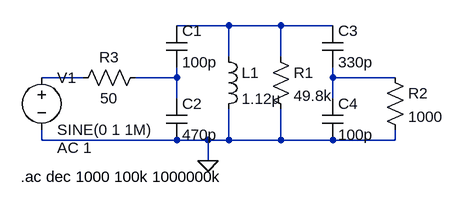
[diagram p0: schematic Circuito_Sintonizante.asc]
Circuito_Sintonizante.asc, the LTspice schematic file:
Version 4
SHEET 1 880 680
WIRE 112 112 32 112
WIRE 192 112 112 112
WIRE 272 112 192 112
WIRE 112 160 112 112
WIRE 192 160 192 112
WIRE -112 192 -176 192
WIRE 32 192 32 176
WIRE 32 192 -32 192
WIRE 272 192 272 176
WIRE 368 192 272 192
WIRE 32 224 32 192
WIRE 272 224 272 192
WIRE -176 288 -176 272
WIRE 32 288 -176 288
WIRE 80 288 32 288
WIRE 112 288 112 240
WIRE 112 288 80 288
WIRE 192 288 192 240
WIRE 192 288 112 288
WIRE 272 288 192 288
WIRE 368 288 368 272
WIRE 368 288 272 288
WIRE 80 320 80 288
FLAG 80 320 0
SYMBOL cap 16 112 R0
SYMATTR InstName C1
SYMATTR Value 100p
SYMBOL cap 16 224 R0
SYMATTR InstName C2
SYMATTR Value 470p
SYMBOL res 176 144 R0
SYMATTR InstName R1
SYMATTR Value 49.8k
SYMBOL ind 96 144 R0
SYMATTR InstName L1
SYMATTR Value 1.12µ
SYMBOL cap 256 112 R0
SYMATTR InstName C3
SYMATTR Value 330p
SYMBOL cap 256 224 R0
SYMATTR InstName C4
SYMATTR Value 100p
SYMBOL res 352 176 R0
SYMATTR InstName R2
SYMATTR Value 1000
SYMBOL res -16 176 R90
WINDOW 0 0 56 VBottom 2
WINDOW 3 32 56 VTop 2
SYMATTR InstName R3
SYMATTR Value 50
SYMBOL voltage -176 176 R0
WINDOW 123 24 124 Left 2
WINDOW 39 0 0 Left 0
SYMATTR Value2 AC 1
SYMATTR InstName V1
SYMATTR Value SINE(0 1 1M)
TEXT -208 344 Left 2 !.ac dec 1000 100k 1000000k

The netlist it stands for:
* Circuito_Sintonizante.asc
C1 N001 N003 100p
C2 N003 0 470p
R1 N001 0 49.8k
L1 N001 0 1.12µ
C3 N001 N004 330p
C4 N004 0 100p
R2 N004 0 1000
R3 N003 N002 50
V1 N002 0 SINE(0 1 1M) AC 1
.ac dec 1000 100k 1000000k
.backanno
.end